# EAGLE design On Board Computer (EAGLE 9.6.2)
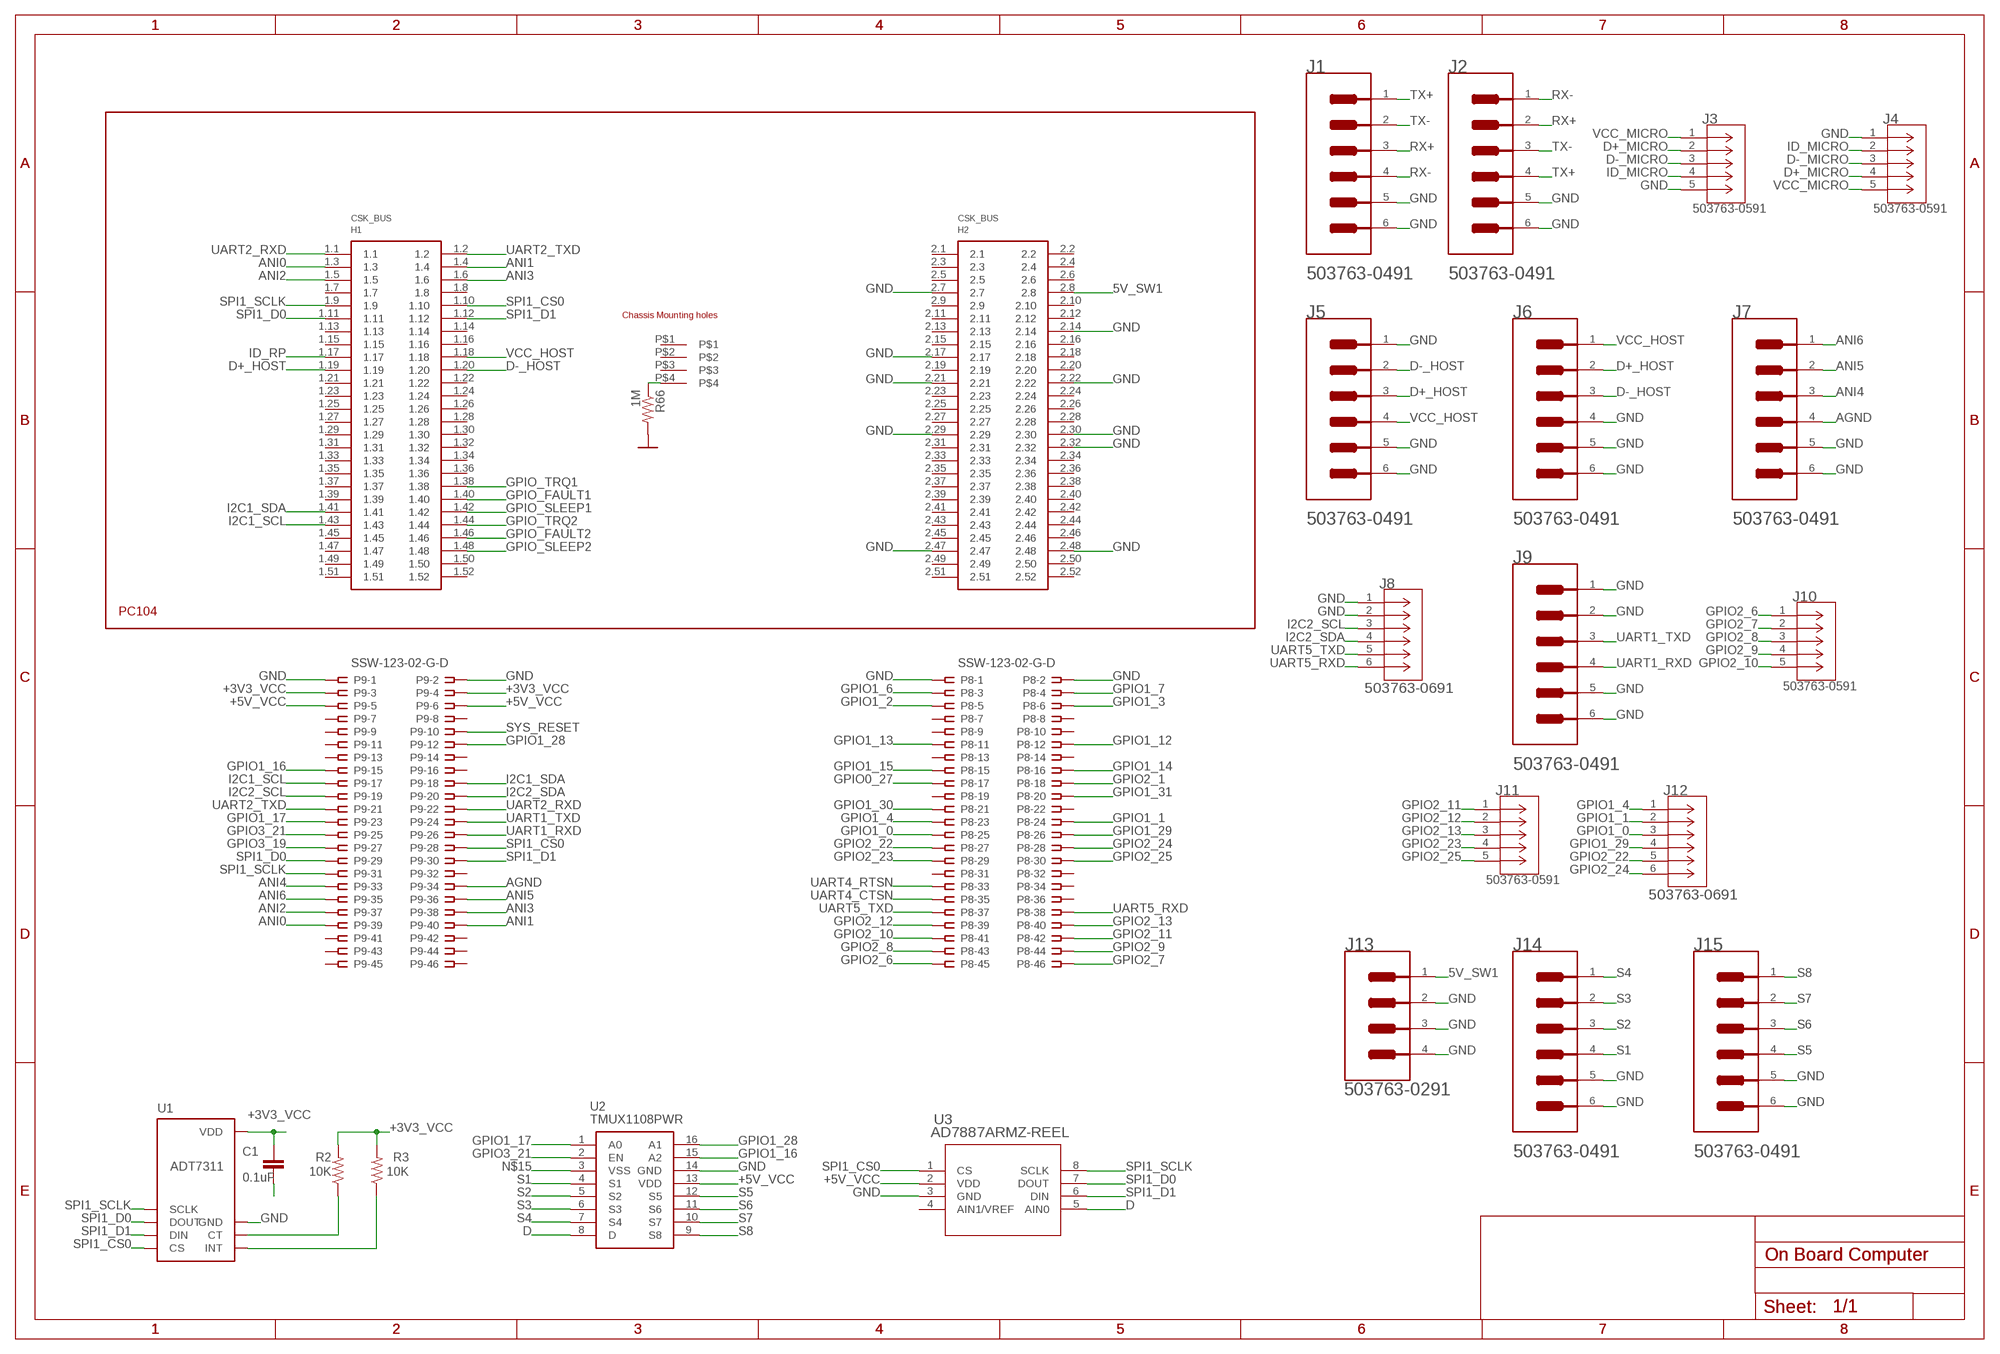
[diagram p0: schematic, sheet 1]

## Parts
C1  0.1uF  CAP0805  [0805]
H1  PC104_WCONN  [PC104_WCONN]
J1  MOLEX_503763-0491MOLEX_503763-0491_0_0  [MOLEX_503763-0491_0]
J2  MOLEX_503763-0491MOLEX_503763-0491_0_0  [MOLEX_503763-0491_0]
J3  503763-0591  [CONN_5037630591_MOL]
J4  503763-0591  [CONN_5037630591_MOL]
J5  MOLEX_503763-0491MOLEX_503763-0491_0_0  [MOLEX_503763-0491_0]
J6  MOLEX_503763-0491MOLEX_503763-0491_0_0  [MOLEX_503763-0491_0]
J7  MOLEX_503763-0491MOLEX_503763-0491_0_0  [MOLEX_503763-0491_0]
J8  503763-0691  [CONN_503763-0691_MOL]
J9  MOLEX_503763-0491MOLEX_503763-0491_0_0  [MOLEX_503763-0491_0]
J10  503763-0591  [CONN_5037630591_MOL]
J11  503763-0591  [CONN_5037630591_MOL]
J12  503763-0691  [CONN_503763-0691_MOL]
J13  MOLEX_503763-0291MOLEX_503763-0291_0_0  [MOLEX_503763-0291_0]
J14  MOLEX_503763-0491MOLEX_503763-0491_0_0  [MOLEX_503763-0491_0]
J15  MOLEX_503763-0491MOLEX_503763-0491_0_0  [MOLEX_503763-0491_0]
P8  SSW-123-02-G-D  [SSW-123-02-G-D]
P9  SSW-123-02-G-D  [SSW-123-02-G-D]
R2  10K  RESISTOR0805-RES  [0805]
R3  10K  RESISTOR0805-RES  [0805]
R66  1M  RESISTOR0805-RES  [0805]
U1  ADT7311  [SOIC-8]
U2  TMUX1108PWR  [SOP65P640X120-16N]
U3  AD7887ARMZ-REEL  [RM_8_ADI]

## Nets
5V_SW1: H1.2.8 J13.1
+3V3_VCC: C1.1 P9.3 P9.4 R2.2 R3.2 U1.8(VDD)
+5V_VCC: P9.5 P9.6 U2.13(VDD) U3.2(VDD)
AGND: J7.4 P9.34
ANI0: H1.1.3 P9.39
ANI1: H1.1.4 P9.40
ANI2: H1.1.5 P9.37
ANI3: H1.1.6 P9.38
ANI4: J7.3 P9.33
ANI5: J7.2 P9.36
ANI6: J7.1 P9.35
D: U2.8(D) U3.5(AIN0)
D+_HOST: H1.1.19 J5.3 J6.2
D+_MICRO: J3.2 J4.4
D-_HOST: H1.1.20 J5.2 J6.3
D-_MICRO: J3.3 J4.3
GND: C1.2 H1.2.7 H1.2.14 H1.2.17 H1.2.21 H1.2.22 H1.2.29 H1.2.30 H1.2.32 H1.2.47 H1.2.48 J1.5(MNT_1) J1.6(MNT_2) J2.5(MNT_1) J2.6(MNT_2) J3.5 J4.1 J5.1 J5.5(MNT_1) J5.6(MNT_2) J6.4 J6.5(MNT_1) J6.6(MNT_2) J7.5(MNT_1) J7.6(MNT_2) J8.1 J8.2 J9.1 J9.2 J9.5(MNT_1) J9.6(MNT_2) J13.2 J13.3(MNT_1) J13.4(MNT_2) J14.5(MNT_1) J14.6(MNT_2) J15.5(MNT_1) J15.6(MNT_2) P8.1 P8.2 P9.1 P9.2 R66.2 U1.7(GND) U2.14(GND) U3.3(GND)
GPIO0_27: P8.17
GPIO1_0: J12.3 P8.25
GPIO1_1: J12.2 P8.24
GPIO1_2: P8.5
GPIO1_3: P8.6
GPIO1_4: J12.1 P8.23
GPIO1_6: P8.3
GPIO1_7: P8.4
GPIO1_12: P8.12
GPIO1_13: P8.11
GPIO1_14: P8.16
GPIO1_15: P8.15
GPIO1_16: P9.15 U2.15(A2)
GPIO1_17: P9.23 U2.1(A0)
GPIO1_28: P9.12 U2.16(A1)
GPIO1_29: J12.4 P8.26
GPIO1_30: P8.21
GPIO1_31: P8.20
GPIO2_1: P8.18
GPIO2_6: J10.1 P8.45
GPIO2_7: J10.2 P8.46
GPIO2_8: J10.3 P8.43
GPIO2_9: J10.4 P8.44
GPIO2_10: J10.5 P8.41
GPIO2_11: J11.1 P8.42
GPIO2_12: J11.2 P8.39
GPIO2_13: J11.3 P8.40
GPIO2_22: J12.5 P8.27
GPIO2_23: J11.4 P8.29
GPIO2_24: J12.6 P8.28
GPIO2_25: J11.5 P8.30
GPIO3_19: P9.27
GPIO3_21: P9.25 U2.2(EN)
GPIO_FAULT1: H1.1.40
GPIO_FAULT2: H1.1.46
GPIO_SLEEP1: H1.1.42
GPIO_SLEEP2: H1.1.48
GPIO_TRQ1: H1.1.38
GPIO_TRQ2: H1.1.44
I2C1_SCL: H1.1.43 P9.17
I2C1_SDA: H1.1.41 P9.18
I2C2_SCL: J8.3 P9.19
I2C2_SDA: J8.4 P9.20
ID_MICRO: J3.4 J4.2
ID_RP: H1.1.17
N$15: U2.3(VSS)
N$94: H1.P$4 R66.1
RX+: J1.3 J2.2
RX-: J1.4 J2.1
S1: J14.4 U2.4(S1)
S2: J14.3 U2.5(S2)
S3: J14.2 U2.6(S3)
S4: J14.1 U2.7(S4)
S5: J15.4 U2.12(S5)
S6: J15.3 U2.11(S6)
S7: J15.2 U2.10(S7)
S8: J15.1 U2.9(S8)
SPI1_CS0: H1.1.10 P9.28 U1.4(CS) U3.1(CS)
SPI1_D0: H1.1.11 P9.29 U1.2(DOUT) U3.7(DOUT)
SPI1_D1: H1.1.12 P9.30 U1.3(DIN) U3.6(DIN)
SPI1_SCLK: H1.1.9 P9.31 U1.1(SCLK) U3.8(SCLK)
SYS_RESET: P9.10
TX+: J1.1 J2.4
TX-: J1.2 J2.3
U11_CT: R2.1 U1.6(CT)
U11_INT: R3.1 U1.5(INT)
UART1_RXD: J9.4 P9.26
UART1_TXD: J9.3 P9.24
UART2_RXD: H1.1.1 P9.22
UART2_TXD: H1.1.2 P9.21
UART4_CTSN: P8.35
UART4_RTSN: P8.33
UART5_RXD: J8.6 P8.38
UART5_TXD: J8.5 P8.37
VCC_HOST: H1.1.18 J5.4 J6.1
VCC_MICRO: J3.1 J4.5
Unconnected: H1.1.7 H1.1.8 H1.1.13 H1.1.14 H1.1.15 H1.1.16 H1.1.21 H1.1.22 H1.1.23 H1.1.24 H1.1.25 H1.1.26 H1.1.27 H1.1.28 H1.1.29 H1.1.30 H1.1.31 H1.1.32 H1.1.33 H1.1.34 H1.1.35 H1.1.36 H1.1.37 H1.1.39 H1.1.45 H1.1.47 H1.1.49 H1.1.50 H1.1.51 H1.1.52 H1.2.1 H1.2.2 H1.2.3 H1.2.4 H1.2.5 H1.2.6 H1.2.9 H1.2.10 H1.2.11 H1.2.12 H1.2.13 H1.2.15 H1.2.16 H1.2.18 H1.2.19 H1.2.20 H1.2.23 H1.2.24 H1.2.25 H1.2.26 H1.2.27 H1.2.28 H1.2.31 H1.2.33 H1.2.34 H1.2.35 H1.2.36 H1.2.37 H1.2.38 H1.2.39 H1.2.40 H1.2.41 H1.2.42 H1.2.43 H1.2.44 H1.2.45 H1.2.46 H1.2.49 H1.2.50 H1.2.51 H1.2.52 H1.P$1 H1.P$2 H1.P$3 P8.7 P8.8 P8.9 P8.10 P8.13 P8.14 P8.19 P8.22 P8.31 P8.32 P8.34 P8.36 P9.7 P9.8 P9.9 P9.11 P9.13 P9.14 P9.16 P9.32 P9.41 P9.42 P9.43 P9.44 P9.45 P9.46 U3.4(AIN1/VREF)

## Library data of the parts
C1 = HSFL_Main_Library:CAP: Capacitor Standard 0603 ceramic capacitor, and 0.1" leaded capacitor.
H1 = HSFL_Main_Library:PC104_WCONN
J1 J2 J5-J7 J9 J14 J15 = Molex - 503763-0491:MOLEX_503763-0491: Wire-To-Board Connector, Pico-Lock 503763 Series, Surface Mount, Header, 4 Contacts, 1 mm; AUTOMOTIVE: No; CENTROID_NOT_SPECIFIED: No; CONN_GENDER: Male; CONN_ORIENTATION: Right Angle; CONTACT_MATERIAL: Gold,Nickel; CURRENT_RATING: 1.5A; DATASHEET: https://www.molex.com/webdocs/datasheets/pdf/en-us/5037630491_PCB_HEADERS.pdf; DEVICE_CLASS_L1: Connectors; DEVICE_CLASS_L2: Headers and Wire Housings; DEVICE_CLASS_L3: unset; DIGIKEY_DESCRIPTION: CONN HEADER 1MM R/A 4CKT; DIGIKEY_PART_NUMBER: WM10655CT-ND; FOOTPRINT_URL: https://www.molex.com/pdm_docs/sd/5037630491_sd.pdf; FOOTPRINT_VARIANT_NAME_0: Recommended_Land_Pattern; HEIGHT: 1.7mm; LEAD_FREE: Yes; MF: Molex; MFG_PACKAGE_IDENT: 503763-0491; MFG_PACKAGE_IDENT_DATE: 0; MFG_PACKAGE_IDENT_REV: 0; MOUSER_PART_NUMBER: 538-503763-0491; MPN: 503763-0491; NUMBER_OF_CONTACTS: 4; NUMBER_OF_ROWS: 1; PACKAGE: HDR4; PITCH: 1mm; PREFIX: J; ROHS: Yes; TEMPERATURE_RANGE_HIGH: +105°C; TEMPERATURE_RANGE_LOW: -40°C; VERIFICATION_VERSION: 0.0.0.1; VOLTAGE_RATING: 150V
J3 J4 J10 J11 = Molex - 503763-0591:503763-0591; BUILT_BY: EMA_Cory; COPYRIGHT: Copyright (C) 2018 Accelerated Designs. All rights reserved; DATASHEET: https://www.molex.com/pdm_docs/sd/5037630591_sd.pdf; MANUFACTURER_PART_NUMBER: 503763-0591; SOURCELIBRARY: Add_to_database_2020-12-14; VENDOR: Molex Connector Corporation
J8 J12 = Molex - 503763-0691:503763-0691; BUILT_BY: EMA_Cory; COPYRIGHT: Copyright (C) 2018 Accelerated Designs. All rights reserved; DATASHEET: https://www.digikey.com/products/en?keywords=503763-0691; MANUFACTURER_PART_NUMBER: 503763-0691; SOURCELIBRARY: Molex_2020-01-22; VENDOR: Molex Connector Corporation
J13 = Molex - 503763-0291:MOLEX_503763-0291: 2 Positions Header Connector 0.039" (1.00mm) Surface Mount, Right Angle Gold; CENTROID_NOT_SPECIFIED: No; DATASHEET: http://www.molex.com/pdm_docs/sd/5037630291_sd.pdf; DIGIKEY_DESCRIPTION: CONN HEADER 1MM R/A 2CKT; DIGIKEY_PART_NUMBER: WM10654CT-ND; LEAD_FREE: yes; MF: Molex; MOUSER_PART_NUMBER: 538-503763-0291; MPN: 503763-0291; PACKAGE: HDR02; PREFIX: J; ROHS: yes; TEMPERATURE_RANGE_HIGH: +105°C; TEMPERATURE_RANGE_LOW: -40°C
P8 P9 = con-samtec:SSW-123-02-G: THROUGH-HOLE .025" SQ POST SOCKET Source: Samtec SSW.pdf; MF: Samtec Inc.; MPN: SSW-123-02-G-D; OC_FARNELL: unknown; OC_NEWARK: 11P9690
R2 R3 R66 = HSFL_Main_Library:RESISTOR: Resistor Basic schematic elements and footprints for 0603, 1206, and PTH resistors.
U1 = HSFL_Main_Library:ADT7311: The ADT7311 is a high accuracy digital temperature sensor in a narrow 8-lead SOIC package. It contains a band gap temperature reference and a 16-bit ADC to monitor and digitize the temperature to a 0.0078°C resolution. The ADC resolution, by default, is set to 13 bits (0.0625°C). The ADC resolution is a user programmable mode that can be changed through the serial interface. br> The ADT7311 is guaranteed to operate over supply voltages from 2.7 V to 5.5 V. Operating at 3.3 V, the average supply current is typically 210 μA. The ADT7311 has a shutdown mode that powers down the device and offers a shutdown current of typically 2 μA. The ADT7311 is rated for operation over the −40°C to +150°C temperature range. br> The CT pin is an open-drain output that becomes active when the temperature exceeds a programmable critical temperature limit. The default critical temperature limit is 147°C. The INT pin is also an open-drain output that becomes active when the temperature exceeds a programmable limit. The INT and CT pins can operate in either comparator or interrupt mode.
U2 = SamacSys_Parts:TMUX1108PWR: Analog Switch ICs 5V / +/-2.5V, 8:1, low-leakage precision multiplexer 16-TSSOP -40 to 125 Source: Datasheet <http://www.ti.com/lit/ds/symlink/tmux1108.pdf>; DESCRIPTION: Analog Switch ICs 5V / +/-2.5V, 8:1, low-leakage precision multiplexer 16-TSSOP -40 to 125; HEIGHT: 1.2mm; MANUFACTURER_NAME: Texas Instruments; MANUFACTURER_PART_NUMBER: TMUX1108PWR; MOUSER_PART_NUMBER: 595-TMUX1108PWR; MOUSER_PRICE-STOCK: https://www.mouser.co.uk/ProductDetail/Texas-Instruments/TMUX1108PWR?qs=PqoDHHvF6486MXIgK4oQ5g%3D%3D
U3 = Personal:AD7887ARMZ-REEL; BUILT_BY: EMA_UL_Team; MANUFACTURER_PART_NUMBER: AD7887ARMZ-REEL; SOURCELIBRARY: Analog_2012-01-01_5; VENDOR: Analog Devices Inc

## Board
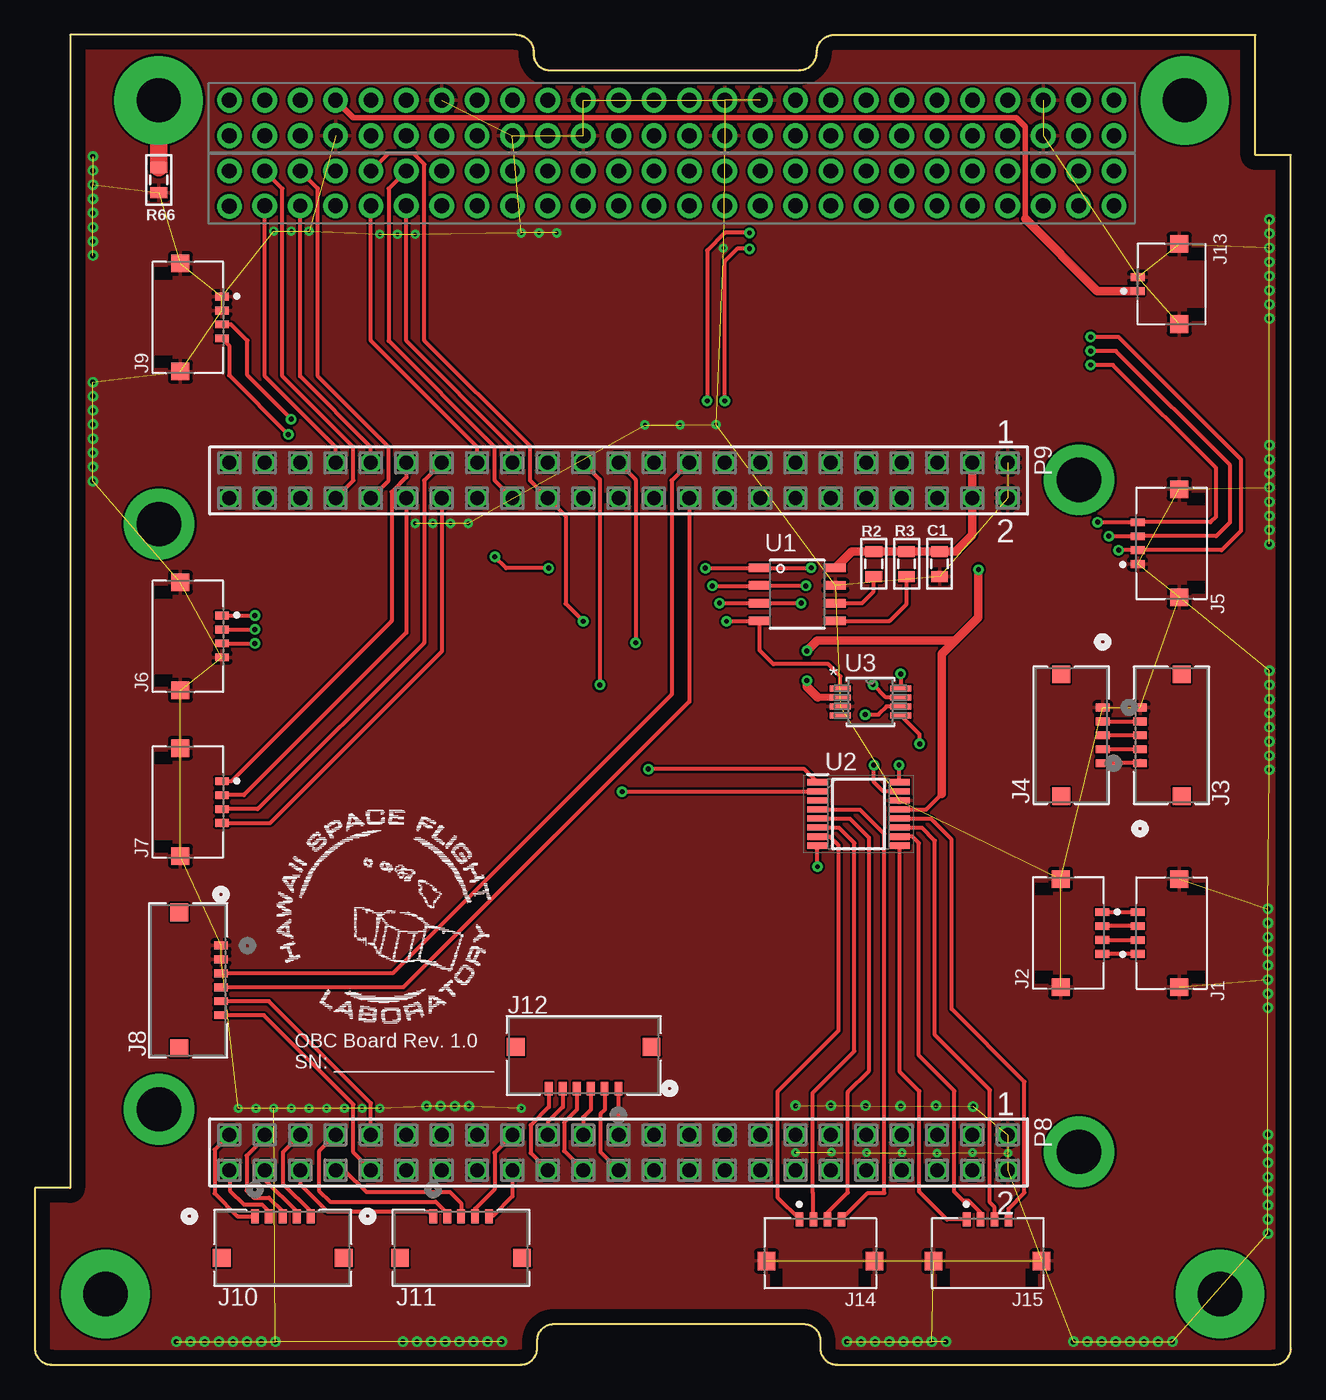
[diagram p1: board, top side]
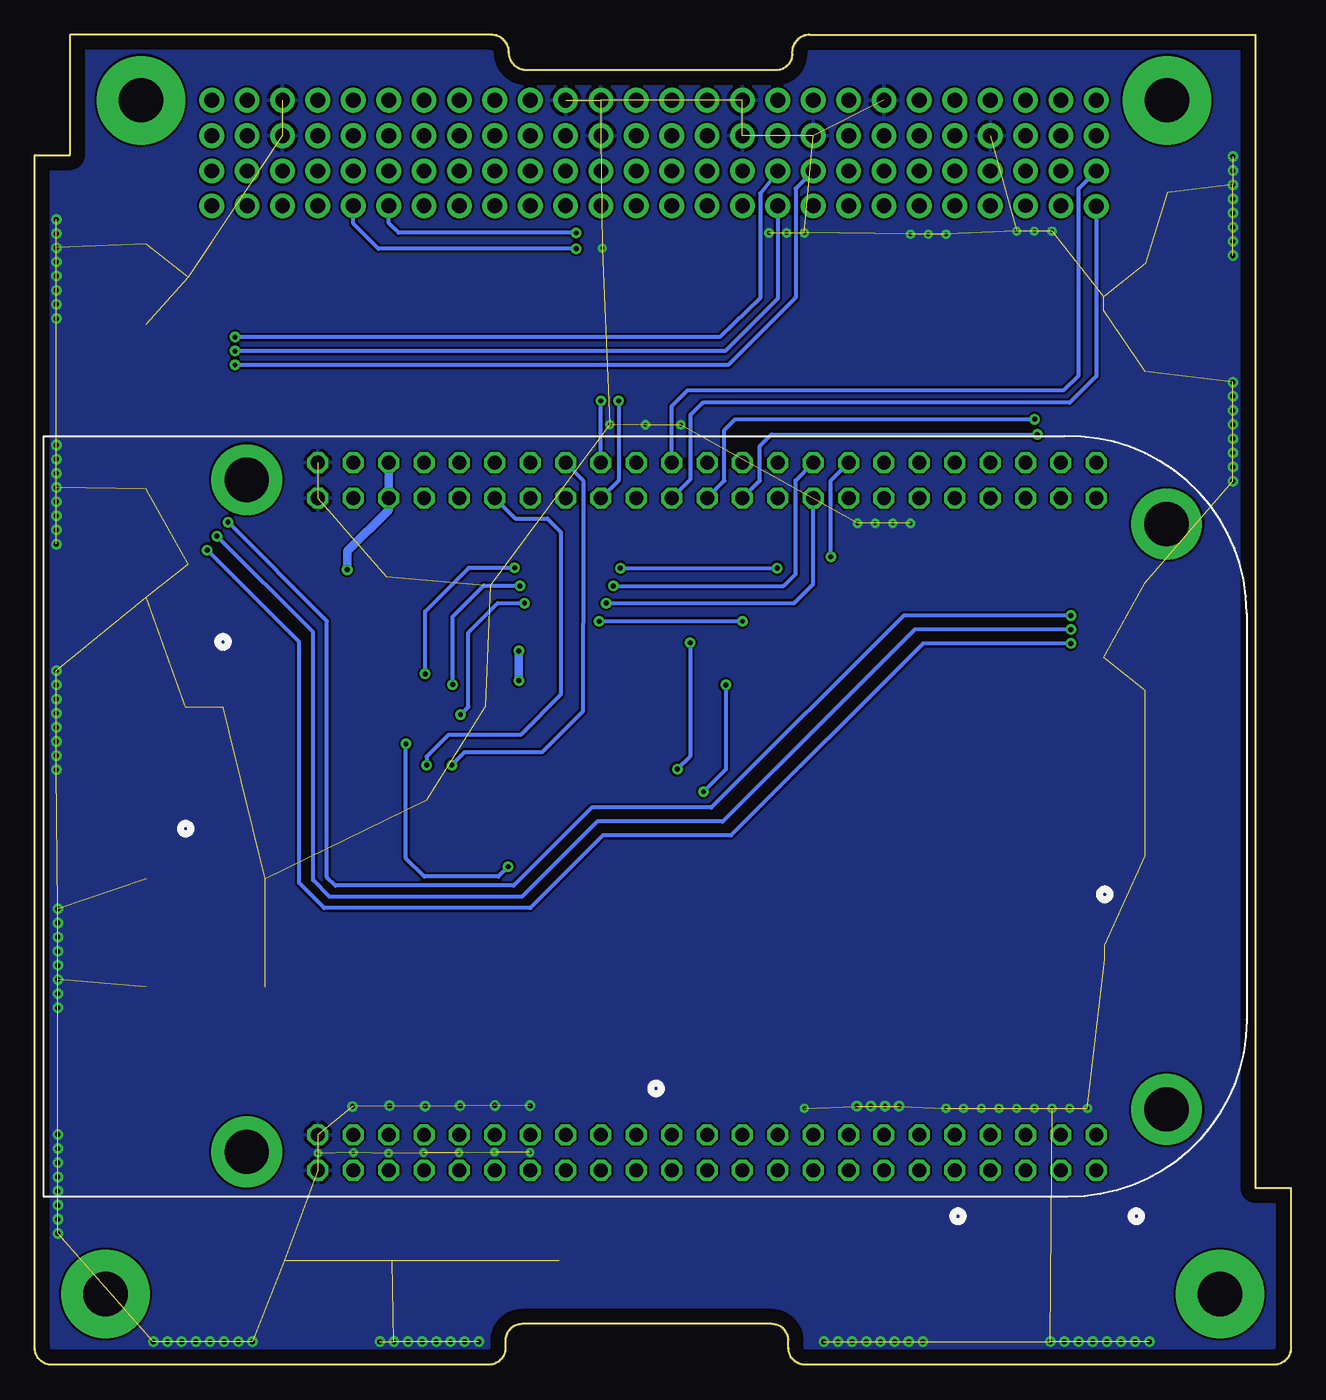
[diagram p2: board, bottom side, seen from below]

Size 90.17 x 95.5 mm. Coordinates in mm from the lower left corner, seen from the top.
Copper layers (1*16): Top 0.035mm / dielectric 1.5mm / Bottom 0.035mm
Design rules "default *": minimum track width 6mil, minimum drill 8mil, track to track 6mil, track to pad 6mil, pad to pad 6mil, via to via 6mil, smd to smd 6mil, copper to edge 40mil, drill to drill 6mil, minimum pad ring 10mil, minimum via ring 8mil, stop-mask expansion 4mil, vias tented up to drill 0mil, thermal gap 10mil

### Footprints (pad centres in the part's own frame; a part is rotated, then mirrored left to right if it is on the bottom)
0805 = smd 0.8 x 1.2: 1 -0.9,0; 2 0.9,0
PC104_WCONN = drill 1.067 pad 1.778: 1.1 13.97,83.185; 1.2 13.97,85.725; 1.3 16.51,83.223; 1.4 16.51,85.725; 1.6 19.05,85.725; 1.7 21.59,83.223; 1.8 21.59,85.725; 1.9 24.13,83.223; 1.10 24.13,85.725; 1.11 26.67,83.223; 1.12 26.67,85.725; 1.13 29.21,83.223; 1.14 29.21,85.725; 1.15 31.75,83.223; 1.16 31.75,85.725; 1.17 34.29,83.223; 1.18 34.29,85.725; 1.19 36.83,83.223; 1.20 36.83,85.725; 1.21 39.37,83.223; 1.22 39.37,85.725; 1.23 41.91,83.223; 1.24 41.91,85.725; 1.25 44.45,83.223; 1.26 44.45,85.725; 1.27 46.99,83.223; 1.28 46.99,85.725; 1.29 49.53,83.223; 1.30 49.53,85.725; 1.31 52.07,83.223; 1.32 52.07,85.725; 1.33 54.61,83.223; 1.34 54.61,85.725; 1.35 57.15,83.223; 1.36 57.15,85.725; 1.37 59.69,83.223; 1.38 59.69,85.725; 1.39 62.23,83.223; 1.40 62.23,85.725; 1.41 64.77,83.223; 1.42 64.77,85.725; 1.43 67.31,83.223; 1.44 67.31,85.725; 1.45 69.85,83.223; 1.46 69.85,85.725; 1.47 72.39,83.223; 1.48 72.39,85.725; 1.49 74.93,83.223; 1.50 74.93,85.725; 1.51 77.47,83.223; 1.52 77.47,85.725; 2.1 13.97,88.265; 2.2 13.97,90.805; 2.3 16.51,88.265; 2.4 16.51,90.805; 2.5 19.05,88.265; 2.6 19.05,90.805; 2.7 21.59,88.265; 2.8 21.59,90.805; 2.9 24.13,88.265; 2.10 24.13,90.805; 2.11 26.67,88.265; 2.12 26.67,90.805; 2.13 29.21,88.265; 2.14 29.21,90.805; 2.15 31.75,88.265; 2.16 31.75,90.805; 2.17 34.29,88.265; 2.18 34.29,90.805; 2.19 36.83,88.265; 2.20 36.83,90.805; 2.21 39.37,88.265; 2.22 39.37,90.805; 2.23 41.91,88.265; 2.24 41.91,90.805; 2.25 44.45,88.265; 2.26 44.45,90.805; 2.27 46.99,88.265; 2.28 46.99,90.805; 2.29 49.53,88.265; 2.30 49.53,90.805; 2.31 52.07,88.265; 2.32 52.07,90.805; 2.33 54.61,88.265; 2.34 54.61,90.805; 2.35 57.15,88.265; 2.36 57.15,90.805; 2.37 59.69,88.265; 2.38 59.69,90.805; 2.39 62.23,88.265; 2.40 62.23,90.805; 2.41 64.77,88.265; 2.42 64.77,90.805; 2.43 67.31,88.265; 2.44 67.31,90.805; 2.45 69.85,88.265; 2.46 69.85,90.805; 2.47 72.39,88.265; 2.48 72.39,90.805; 2.49 74.93,88.265; 2.50 74.93,90.805; 2.51 77.47,88.265; 2.52 77.47,90.805 | drill 1.016 pad 1.778: 1.5 19.05,83.223 | drill 3.175 pad 6.35: P$1 5.08,5.08; P$2 85.09,5.08; P$3 82.55,90.805; P$4 8.89,90.805
MOLEX_503763-0491_0 = smd 0.55 x 1: 1 1.5,-2.435; 2 0.5,-2.435; 3 -0.5,-2.435; 4 -1.5,-2.435 | smd 1.26 x 1.3: 5 -3.875,0.555; 6 3.875,0.555
CONN_5037630591_MOL = smd 0.559 x 0.991: 1 -2,2.261; 2 -1,2.261; 3 0,2.261; 4 1,2.261; 5 2,2.261 | smd 1.27 x 1.295: 6 -4.375,-0.729; 7 4.375,-0.729
CONN_503763-0691_MOL = smd 0.559 x 0.991: 1 2.5,-2.368; 2 1.5,-2.368; 3 0.5,-2.368; 4 -0.5,-2.368; 5 -1.5,-2.368; 6 -2.5,-2.368 | smd 1.27 x 1.295: 7 -4.875,0.622; 8 4.875,0.622
MOLEX_503763-0291_0 = smd 0.55 x 1: 1 0.5,-2.435; 2 -0.5,-2.435 | smd 1.26 x 1.3: 3 -2.875,0.555; 4 2.875,0.555
SSW-123-02-G-D = drill 1 pad 1.5 octagon: 1 -27.94,-1.27; 2 -27.94,1.27; 3 -25.4,-1.27; 4 -25.4,1.27; 5 -22.86,-1.27; 6 -22.86,1.27; 7 -20.32,-1.27; 8 -20.32,1.27; 9 -17.78,-1.27; 10 -17.78,1.27; 11 -15.24,-1.27; 12 -15.24,1.27; 13 -12.7,-1.27; 14 -12.7,1.27; 15 -10.16,-1.27; 16 -10.16,1.27; 17 -7.62,-1.27; 18 -7.62,1.27; 19 -5.08,-1.27; 20 -5.08,1.27; 21 -2.54,-1.27; 22 -2.54,1.27; 23 0,-1.27; 24 0,1.27; 25 2.54,-1.27; 26 2.54,1.27; 27 5.08,-1.27; 28 5.08,1.27; 29 7.62,-1.27; 30 7.62,1.27; 31 10.16,-1.27; 32 10.16,1.27; 33 12.7,-1.27; 34 12.7,1.27; 35 15.24,-1.27; 36 15.24,1.27; 37 17.78,-1.27; 38 17.78,1.27; 39 20.32,-1.27; 40 20.32,1.27; 41 22.86,-1.27; 42 22.86,1.27; 43 25.4,-1.27; 44 25.4,1.27; 45 27.94,-1.27; 46 27.94,1.27
SOIC-8 = smd 1.524 x 0.61: 1 -2.68,1.855; 2 -2.68,0.585; 3 -2.68,-0.685; 4 -2.68,-1.955; 5 2.78,-1.955; 6 2.78,-0.685; 7 2.78,0.585; 8 2.78,1.855
SOP65P640X120-16N = smd 1.475 x 0.45: 1 -2.938,2.275; 2 -2.938,1.625; 3 -2.938,0.975; 4 -2.938,0.325; 5 -2.938,-0.325; 6 -2.938,-0.975; 7 -2.938,-1.625; 8 -2.938,-2.275; 9 2.938,-2.275; 10 2.938,-1.625; 11 2.938,-0.975; 12 2.938,-0.325; 13 2.938,0.325; 14 2.938,0.975; 15 2.938,1.625; 16 2.938,2.275
RM_8_ADI = smd 1.524 x 0.432: 1 -2.172,0.975; 2 -2.172,0.325; 3 -2.172,-0.325; 4 -2.172,-0.975; 5 2.172,-0.975; 6 2.172,-0.325; 7 2.172,0.325; 8 2.172,0.975

### Placement (x,y rotation side)
C1  64.95,57.51 270 top
H1  0,0 0 top
J1  81.6,31 270 top
J2  74.2,31 90 top
J3  81.6,45.2 90 top
J4  74.4,45.2 270 top
J5  81.6,59 270 top
J6  11,52.3 90 top
J7  11,40.4 90 top
J8  11,27.6 90 top
J9  11,75.2 90 top
J10  17.8,8.4 0 top
J11  30.6,8.4 0 top
J12  39.4,22.2 0 top
J13  81.6,77.6 270 top
J14  56.4,8 180 top
J15  68.4,8 180 top
P8  41.91,15.24 180 top
P9  41.91,63.5 180 top
R2  60.22,57.51 90 top
R3  62.59,57.51 90 top
R66  8.89,85.07 270 top
U1  54.69,55.37 0 top
U2  59.13,39.55 0 top
U3  59.99,47.6 0 top

### Tracks (layer width: path | path; a pad name or v marks a point on that pad's centre or on a via)
5V_SW1
  Top 0.406: H1.2.8 22.86,89.53 70.47,89.53 71.09,88.91 71.09,82.29
  Top 0.61: J13.1 76.28,77.1 71.09,82.29
+3V3_VCC
  Top 0.61: P9.3 P9.4 67.31,59.59 66.13,58.41 C1.1 R3.2 R2.2 58.65,58.41 U1.8
+5V_VCC  (via drill 0.35)
  Top 0.305: U2.13 63.98,39.87 65.1,41
  Top 0.508: U3.2 56.19,47.92
  Top 0.61: 65.1,41 65.1,51.03 66.06,51.99 | 56.19,47.92 55.42,48.69 v55.42,49.12 55.42,49.15 | v55.42,51.26 56.16,51.99 66.06,51.99 | v67.74,57.1 67.74,53.67 66.06,51.99
  Bottom 0.61: P9.5 P9.6 64.77,61.39 67.74,58.42 v67.74,57.1 | v55.42,49.12 v55.42,51.26 55.42,51.28
AGND
  Top 0.305: J7.4 16.9,38.9 29.21,51.21 P9.34
ANI0
  Top 0.305: P9.39 21.59,65.91 16.51,70.99 H1.1.3
ANI1
  Top 0.305: P9.40 22.86,63.5 22.86,65.91 17.78,70.99 17.78,84.45 H1.1.4
ANI2
  Top 0.305: P9.37 24.13,65.91 19.05,70.99 H1.1.5
ANI3
  Top 0.305: P9.38 25.4,63.5 25.4,65.91 20.32,70.99 20.32,84.45 H1.1.6
ANI4
  Top 0.305: P9.33 27.94,63.5 27.94,51.84 16,39.9 J7.3
ANI5
  Top 0.305: P9.36 26.67,52.57 15,40.9 J7.2
ANI6
  Top 0.305: P9.35 26.67,63.73 25.61,62.67 25.61,61.11 | 25.6,61.1 25.61,61.11 | 25.61,61.11 25.61,53.41 14.1,41.9 J7.1
D  (via drill 0.35)
  Top 0.305: 56.18,37.29 U2.8 v56.19,35.76 | v63.52,44.58 63.52,45.27 U3.5
  Bottom 0.305: v56.19,35.76 56.9,35.05 62.2,35.05 63.52,36.37 v63.52,44.58 63.52,44.6
D+_HOST  (via drill 0.35)
  Top 0.305: J6.2 v15.8,52.8 | v77.1,59.5 | v77.1,59.5 J5.3 84.8,59.5 85.8,60.5 85.8,64.6 77.6,72.8 v75.8,72.8
  Bottom 0.305: H1.1.19 36.83,76.57 40.6,72.8 v75.8,72.8 | v15.8,52.8 27,52.8 40.8,39 49.8,39 55.2,33.6 69,33.6 70.2,34.8 70.2,52.6 v77.1,59.5
D+_MICRO
  Top 0.305: J4.4 J3.2
D-_HOST  (via drill 0.35)
  Top 0.305: J6.3 v15.8,51.8 | v77.8,58.5 J5.2 85.2,58.5 86.6,59.9 86.6,65 77.8,73.8 v75.8,73.8 | v77.8,58.5
  Bottom 0.305: H1.1.20 38.1,84.1 38.1,76.6 41,73.8 v75.8,73.8 | v15.8,51.8 26.4,51.8 40.2,38 49.4,38 54.6,32.8 69.4,32.8 71.2,34.6 71.2,51.9 v77.8,58.5
D-_MICRO
  Top 0.305: J3.3 J4.3
GND  (via drill 0.2 pad 0.41, 0.25, 0.35)  (177 unrouted)
  other vias: 54.61,18.59 57.15,18.62 59.64,18.59 62.15,18.57 64.69,18.59 67.36,18.54 10.16,1.65 12.19,1.65 13.21,1.65 14.22,1.65 15.24,1.65 16.26,1.65 17.27,1.65 11.18,1.65 26.42,1.65 27.43,1.65 28.45,1.65 29.46,1.65 30.48,1.65 31.5,1.65 32.51,1.65 33.53,1.65 4.17,79.65 4.17,81.69 4.17,82.7 4.17,83.72 4.17,84.73 4.17,85.75 4.17,86.77 4.17,80.67 4.17,63.45 4.17,65.48 4.17,66.5 4.17,67.51 4.17,68.53 4.17,69.55 4.17,70.56 4.17,64.47 58.29,1.65 60.33,1.65 61.34,1.65 62.36,1.65 63.37,1.65 64.39,1.65 65.41,1.65 59.31,1.65 74.55,1.65 75.56,1.65 76.58,1.65 77.6,1.65 78.61,1.65 79.63,1.65 80.64,1.65 81.66,1.65 14.61,18.41 15.88,18.41 17.14,18.41 18.41,18.41 19.68,18.41 20.95,18.41 22.23,18.41 23.5,18.41 24.77,18.41 28.12,18.57 29.13,18.57 30.15,18.57 31.17,18.57 34.92,18.41 27.3,60.43 28.57,60.43 29.84,60.43 31.11,60.43 17.14,81.41 18.41,81.41 19.68,81.41 24.77,81.18 26.04,81.18 27.3,81.18 54.61,15.24 34.92,81.28 36.2,81.28 37.47,81.28 49.43,80.19 88.52,25.63 88.52,27.66 88.52,28.68 88.52,29.69 88.52,30.71 88.52,31.72 88.52,32.74 88.52,26.64 88.52,9.42 88.52,11.46 88.52,12.47 88.52,13.49 88.52,14.5 88.52,15.52 88.52,16.54 88.52,10.44 88.62,58.93 88.62,60.96 88.62,61.98 88.62,62.99 88.62,64.01 88.62,65.02 88.62,66.04 88.62,59.94 88.62,42.72 88.62,44.75 88.62,45.77 88.62,46.79 88.62,47.8 88.62,48.82 88.62,49.83 88.62,43.74 88.62,75.13 88.62,77.17 88.62,78.18 88.62,79.2 88.62,80.21 88.62,81.23 88.62,82.25 88.62,76.15 57.18,15.27 59.72,15.21 62.26,15.21 64.77,15.19 67.31,15.24 69.85,15.19 43.79,67.49 48.9,67.51 46.33,67.49
  pour Top: 92.52,-5.29 92.52,98.21 -4.78,98.21 -4.78,-5.29
  pour Bottom: -5.78,98.91 -5.78,-6.19 93.22,-6.19 93.22,98.91
GPIO1_0
  Top 0.305: J12.3 39.9,18.3 39.37,17.77 P8.25
GPIO1_1
  Top 0.305: J12.2 40.9,18.3 40.6,18 40.6,15.28 P8.24
GPIO1_4
  Top 0.305: J12.1 P8.23
GPIO1_16  (via drill 0.35)
  Top 0.305: U2.15 60.91,41.17 60.24,41.85 v60.24,43.07
  Bottom 0.305: P9.15 50.8,63.5 50.8,53.21 50.8,46.94 53.75,43.99 59.31,43.99 v60.24,43.07
GPIO1_17  (via drill 0.35)
  Top 0.305: P9.23 43.13,63.55 v43.13,51.84 | U2.1 55.24,42.77 v44.04,42.77
  Bottom 0.305: v43.13,51.84 43.13,43.69 v44.04,42.77
GPIO1_28  (via drill 0.35)
  Top 0.305: U2.16 62.04,41.85 v62.04,43.07
  Bottom 0.305: v62.04,43.07 62.04,43.67 60.48,45.24 55.3,45.24 52.4,48.13 52.4,59.79 53.38,60.77 55.69,60.77 P9.12
GPIO1_29
  Top 0.305: J12.4 38.9,18.3 38,17.4 38,15.34 P8.26
GPIO2_6
  Top 0.305: P8.45 12.9,15.44 12.9,12.3 14.54,10.66 J10.1
GPIO2_7
  Top 0.305: P8.46 14,13.94 14,12.5 15,11.5 16.3,11.5 16.8,11 J10.2
GPIO2_8
  Top 0.305: P8.43 16.51,16.31 15.2,15 15.2,12.5 15.7,12 16.8,12 17.8,11 J10.3
GPIO2_9
  Top 0.305: P8.44 16.51,13.29 18.8,11 J10.4
GPIO2_10
  Top 0.305: P8.41 17.8,15.26 17.8,13 19.8,11 J10.5
GPIO2_11
  Top 0.305: P8.42 19.05,12.95 21,11 28.26,11 J11.1
GPIO2_12
  Top 0.305: P8.39 20.4,15.32 20.4,12.5 21.2,11.7 28.77,11.7 29.6,10.87 J11.2
GPIO2_13
  Top 0.305: P8.40 22.23,13.97 23.8,12.4 29.8,12.4 30.6,11.6 J11.3
GPIO2_22
  Top 0.305: J12.5 37.9,18.5 36.83,17.43 P8.27
GPIO2_23
  Top 0.305: P8.29 33,15.22 33,15.2 33,12.6 31.6,11.2 J11.4
GPIO2_24
  Top 0.305: J12.6 36.9,18.5 35.6,17.2 35.6,15.2 P8.28
GPIO2_25
  Top 0.305: P8.30 34.29,12.09 32.86,10.66 J11.5
GPIO3_21  (via drill 0.35)
  Top 0.305: P9.25 40.56,63.58 v40.56,48.82 40.59,48.79 | v42.16,41.15 56.17,41.15 U2.2
  Bottom 0.305: v40.56,48.82 40.56,42.75 v42.16,41.15
I2C1_SCL  (via drill 0.35)
  Top 0.305: v49.53,69.22 49.53,79.25 50.42,80.14 v51.31,80.14
  Bottom 0.305: P9.17 v49.53,69.22 | v51.31,80.14 65.51,80.14 67.31,81.94 H1.1.43
I2C1_SDA  (via drill 0.35)
  Top 0.305: v51.31,81.28 49.53,81.28 48.26,80.01 v48.26,69.22
  Bottom 0.305: v48.26,69.22 48.26,63.5 P9.18 | v51.31,81.28 64.06,81.28 64.77,81.99 H1.1.41
I2C2_SCL
  Top 0.305: P9.19 45.72,63.5 45.72,48.13 25.69,28.1 J8.3
I2C2_SDA
  Top 0.305: P9.20 46.99,47.62 26.46,27.1 J8.4
ID_MICRO
  Top 0.305: J4.2 J3.4
N$5  (via drill 3.17 pad 5.08)
  other vias: 74.96,15.29
N$6  (via drill 3.17 pad 5.08)
  other vias: 74.96,63.55
N$7  (via drill 3.17 pad 5.08)
  other vias: 8.92,18.34
N$8  (via drill 3.17 pad 5.08)
  other vias: 8.92,60.37
N$94
  Top 1.27: H1.P$4 8.91,85.99 R66.1
RX+
  Top 0.305: J1.3 J2.2
RX-
  Top 0.305: J2.1 J1.4
S1
  Top 0.305: U2.4 59.24,39.87 60.98,38.13 60.98,12.34 59.81,12.34 J14.4
S2
  Top 0.305: U2.5 58.5,39.22 59.89,37.83 59.89,21.11 58.37,19.58 58.37,12.37 56.9,10.9 J14.3
S3
  Top 0.305: U2.6 57.72,38.57 58.83,37.47 58.83,22.5 55.83,19.51 55.83,12.4 55.83,12.37 55.83,10.5 J14.2
S4
  Top 0.305: U2.7 57.07,37.92 57.71,37.29 57.71,24 53.31,19.61 53.31,12.02 J14.1
S5
  Top 0.305: U2.12 64.31,39.22 65.82,37.71 65.82,25.54 71.05,20.32 71.05,12.34 69.9,11.2 J15.4
S6
  Top 0.305: U2.11 63.66,38.57 64.62,37.62 64.62,23.67 68.56,19.74 68.56,11.64 68.9,11.3 J15.3
S7
  Top 0.305: U2.10 62.99,37.92 63.46,37.45 63.46,22.21 66.02,19.66 66.02,12.4 | 66.02,12.39 66.02,12.4 | 66.02,12.4 66.61,11.8 67,11.8 67.9,10.9 J15.2
S8
  Top 0.305: U2.9 62.07,21.07 63.5,19.63 63.5,12.42 65.48,10.44 J15.1
SPI1_CS0  (via drill 0.35)
  Top 0.305: H1.1.10 25.4,87 27.18,87 27.96,86.21 27.96,73.56 35.56,65.96 35.56,63.5 P9.28 38.1,60.96 38.1,54.66 v39.37,53.39 | v49.66,53.39 51.98,53.39 U1.4 52.01,51.32 53.02,50.3 56.96,50.3 57.82,49.44 U3.1
  Bottom 0.305: v49.66,53.39 v39.37,53.39
SPI1_D0  (via drill 0.35)
  Top 0.305: P9.29 34.29,65.91 26.67,73.53 H1.1.11 | v48.64,55.93 51.98,55.93 U1.2 55.32,55.96 v55.35,55.93 | U3.7 61.09,47.92 v60.17,48.84
  Bottom 0.305: P9.29 35.56,63.5 35.56,56.79 36.42,55.93 v48.64,55.93 | v60.17,48.84 60.17,53.72 57.94,55.96 55.37,55.96 v55.35,55.93
SPI1_D1  (via drill 0.35)
  Top 0.19: 25.4,73.53 25.4,81.25
  Top 0.305: H1.1.12 25.4,84.45 25.4,73.53 33.02,65.91 33.02,63.5 P9.30 | v49.15,54.69 U1.3 v55.02,54.69 | U3.6 61.14,47.27 60.55,46.69 v59.61,46.69
  Bottom 0.305: P9.30 34.29,56.06 35.66,54.69 v49.15,54.69 | v59.61,46.69 59.05,47.24 59.05,52.58 56.95,54.69 v55.02,54.69
SPI1_SCLK  (via drill 0.35)
  Top 0.305: H1.1.9 24.13,73.53 31.75,65.91 P9.31 | v48.13,57.2 51.98,57.2 U1.1 v55.73,57.23 | v36.88,57.2 33.83,57.2 v33.02,58.01 | v62.15,49.61 62.17,49.59 U3.8
  Bottom 0.305: P9.31 33.02,63.5 v33.02,58.01 | v48.13,57.2 v36.88,57.2 | v62.15,49.61 62.13,49.63 | v62.15,49.61 62.18,49.61 | v62.15,49.61 62.15,54.1 59.03,57.23 v55.73,57.23
TX+
  Top 0.305: J1.1 J2.4
TX-
  Top 0.305: J2.3 J1.2
U11_CT
  Top 0.305: U1.6 59.39,54.69 60.22,55.52 R2.1
U11_INT
  Top 0.305: U1.5 61.37,53.42 62.59,54.63 R3.1
UART1_RXD  (via drill 0.35)
  Top 0.305: J9.4 13.95,73.19 13.95,71.05 v18.2,66.8
  Bottom 0.305: P9.26 38.12,63.48 38.12,65.96 37.29,66.8 v18.2,66.8
UART1_TXD  (via drill 0.35)
  Top 0.305: v18.4,67.9 15.25,71.05 15.25,73.55 14.1,74.7 J9.3
  Bottom 0.305: P9.24 40.66,63.48 40.66,67.13 39.9,67.9 v18.4,67.9
UART2_RXD
  Bottom 0.305: P9.22 43.1,63.58 43.1,68.2 42.22,69.09 15.88,69.09 13.97,70.99 H1.1.1
UART2_TXD
  Bottom 0.305: P9.21 44.45,68.83 43.31,69.98 16.31,69.98 15.24,71.05 15.24,84.45 H1.1.2
UART5_RXD
  Top 0.305: P8.38 22.86,15.24 22.86,18.68 16.44,25.1 J8.6
UART5_TXD
  Top 0.305: P8.37 24.13,18.77 16.8,26.1 J8.5
VCC_HOST  (via drill 0.35)
  Top 0.305: J5.4 84.4,60.5 84.8,60.9 84.8,64.4 77.4,71.8 v75.8,71.8 | J6.1 v15.8,53.8 | v76.3,60.5 J5.4 | J5.4
  Bottom 0.305: H1.1.18 35.56,84.45 35.56,76.64 40.4,71.8 v75.8,71.8 | v15.8,53.8 27.8,53.8 41.6,40 50.2,40 55.8,34.4 68.6,34.4 69.2,35 69.2,53.4 v76.3,60.5
VCC_MICRO
  Top 0.305: J3.1 J4.5
  Top 0.61: J3.1

### Text on the board
tNames: OBC Board Rev. 1.0 / SN: ______________